# Altium schematic sheet MCU.SchDoc
size A3
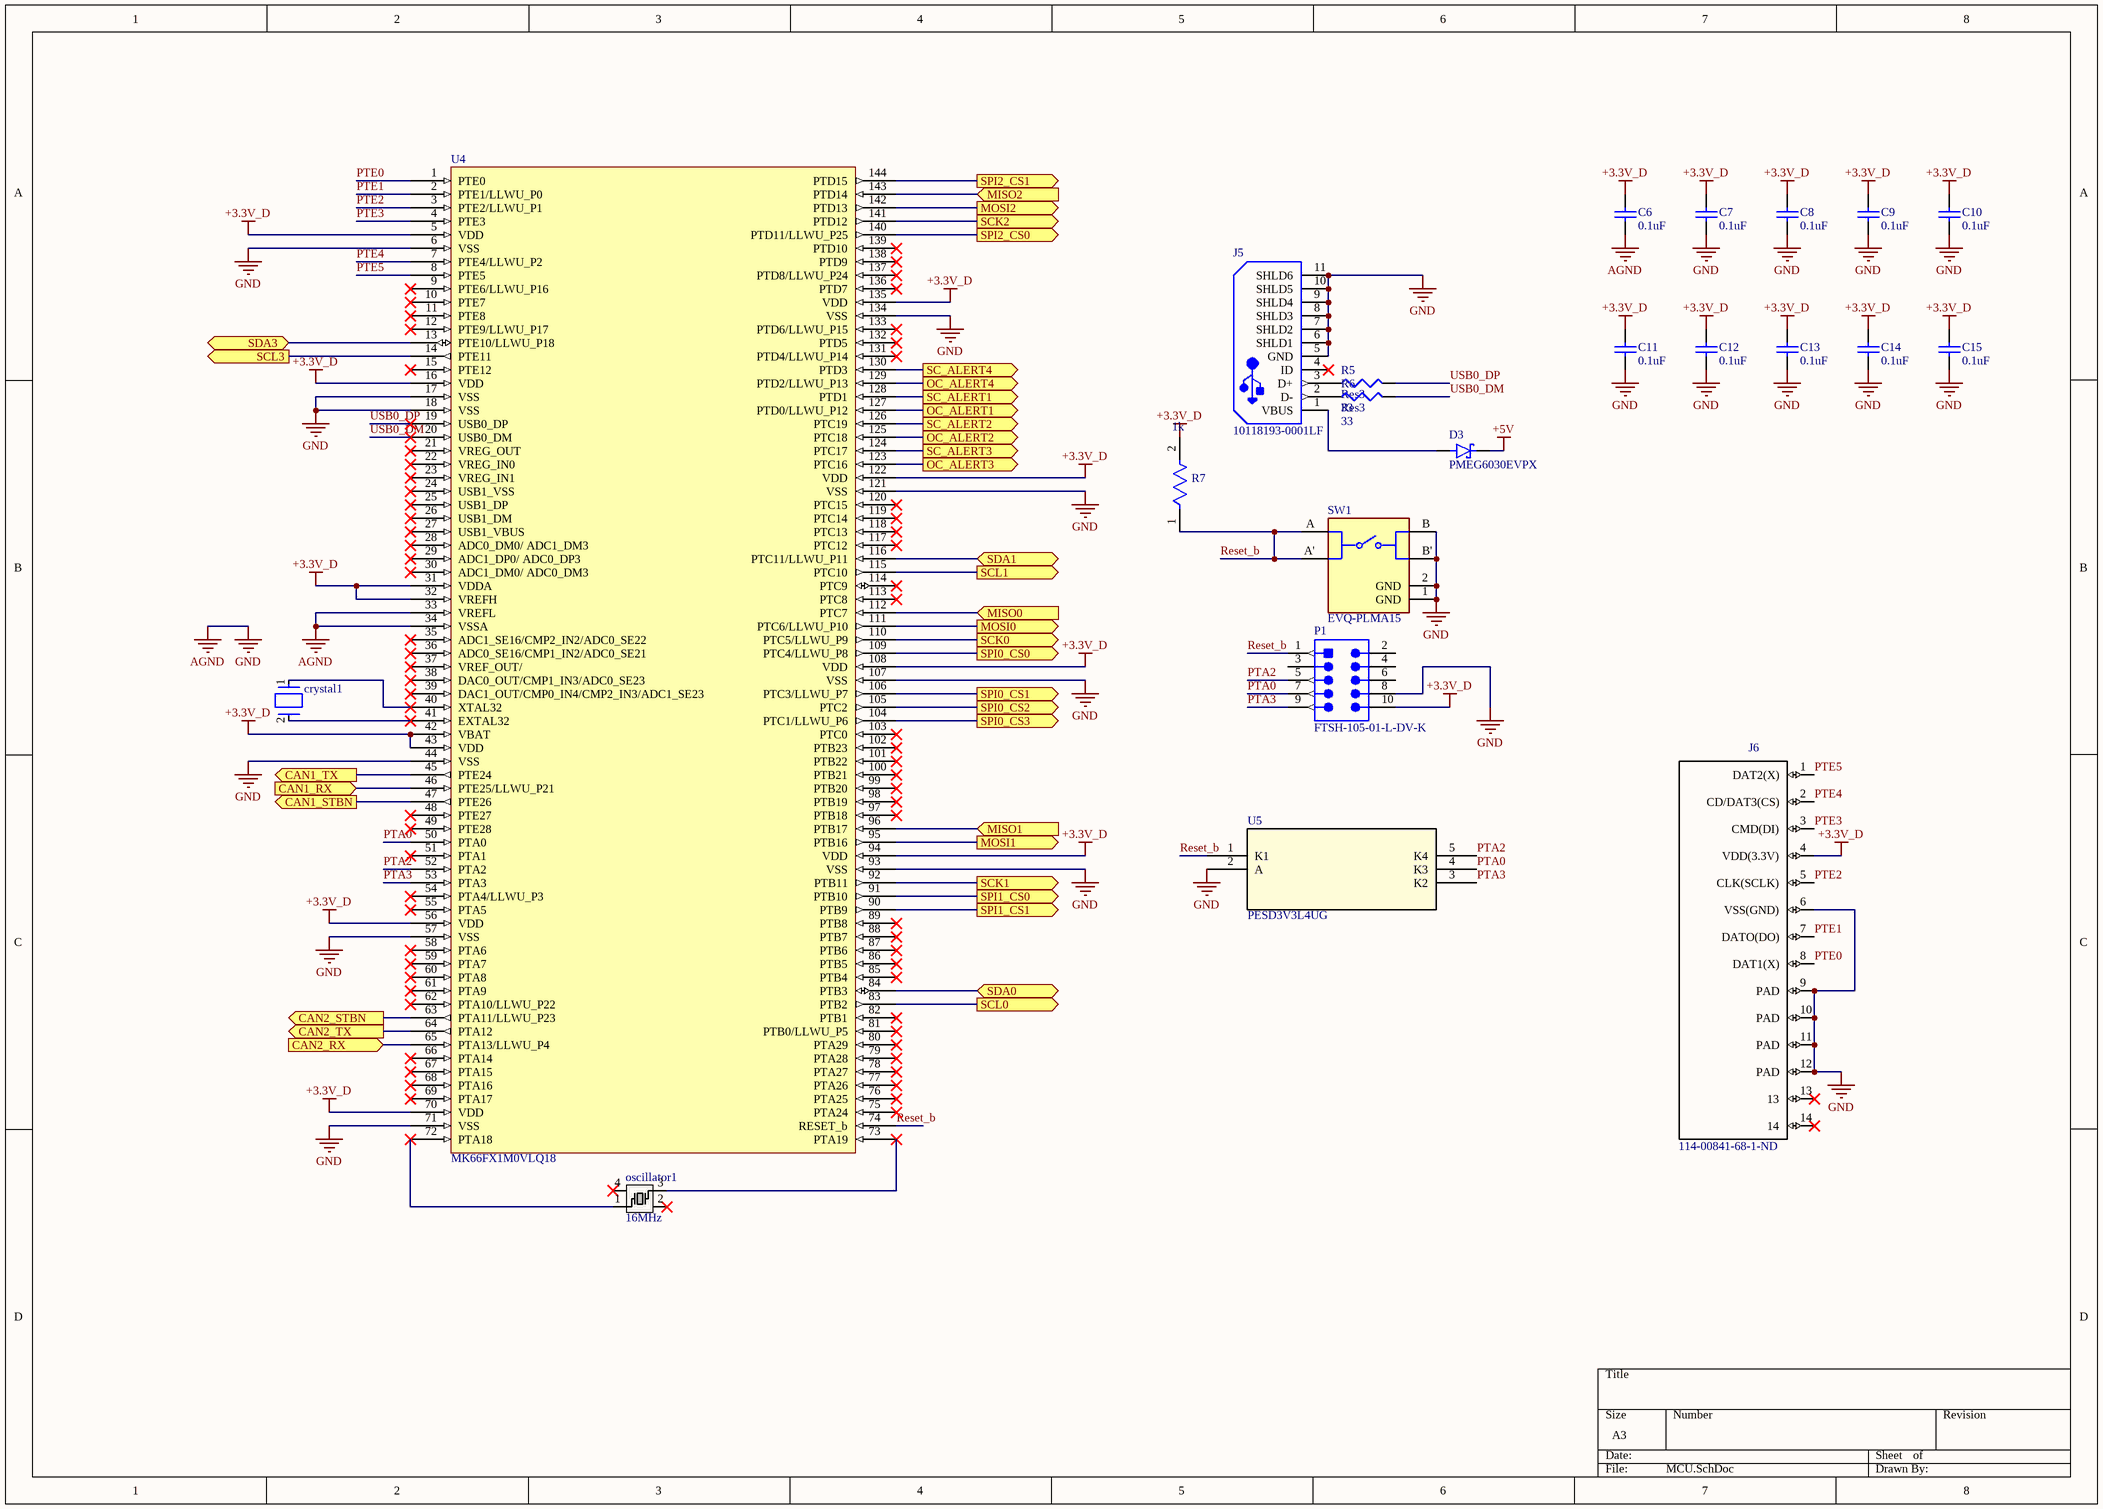
[diagram p0: MCU.SchDoc]

## Parts
C6  0.1uF  [CAPC1608X90X35NL15T15]
C7  0.1uF  [CAPC1608X90X35NL15T15]
C8  0.1uF  [CAPC1608X90X35NL15T15]
C9  0.1uF  [CAPC1608X90X35NL15T15]
C10  0.1uF  [CAPC1608X90X35NL15T15]
C11  0.1uF  [CAPC1608X90X35NL15T15]
C12  0.1uF  [CAPC1608X90X35NL15T15]
C13  0.1uF  [CAPC1608X90X35NL15T15]
C14  0.1uF  [CAPC1608X90X35NL15T15]
C15  0.1uF  [CAPC1608X90X35NL15T15]
crystal1  ABS07-120-32.768KHZ-T  [FP-ABS07-120-MFG]  (value not drawn)
D3  PMEG6030EVPX  [DIO_PMEG6030EVPX]
J5  10118193-0001LF  [FCI-10118193-0001LF-5_V]
J6  Supplier Part Number 1: 114-00841-68-1-ND  [*1140084168]  (hidden comment: 1140084168)
oscillator1  value 16MHz  [ECS-160-8-30B-CKM]  (hidden comment: SMD_oscillator)
P1  FTSH-105-01-L-DV-K  [SMTC-FTSH-105-01-L-DV-K_V]
R5  Res3  value 33  [J1-0603]
R6  Res3  value 33  [J1-0603]
R7  Resistance: 1k  [FP-CRCW0603-e3-MFG]  (hidden comment: CRCW06031K00FKEA)
SW1  EVQ-PLMA15  [FP-EVQ-PLMA15-MFG]
U4  MK66FX1M0VLQ18  [98ASS23177W]
U5  PESD3V3L4UG  [SOT353_NXP]

## Ports
CAN1_RX (in), CAN1_STBN (out), CAN1_TX (out), CAN2_RX (in), CAN2_STBN (out), CAN2_TX (out), MISO0 (in), MISO1 (in), MISO2 (in), MOSI0 (out), MOSI1 (out), MOSI2 (out), OC_ALERT1 (out), OC_ALERT2 (out), OC_ALERT3 (out), OC_ALERT4 (out), SC_ALERT1 (out), SC_ALERT2 (out), SC_ALERT3 (out), SC_ALERT4 (out), SCK0 (out), SCK1 (out), SCK2 (out), SCL0 (out), SCL1 (out), SCL3 (out), SDA0 (bidir), SDA1 (bidir), SDA3 (bidir), SPI0_CS0 (out), SPI0_CS1 (out), SPI0_CS2 (out), SPI0_CS3 (out), SPI1_CS0 (out), SPI1_CS1 (out), SPI2_CS0 (out), SPI2_CS1 (out)

## Nets
+3.3V_D: C6.2 C7.2 C8.2 C9.2 C10.2 C11.2 C12.2 C13.2 C14.2 C15.2 J6.4(VDD(3.3V)) P1.10 R7.2 U4.5(VDD) U4.16(VDD) U4.31(VDDA) U4.32(VREFH) U4.42(VBAT) U4.43(VDD) U4.56(VDD) U4.70(VDD) U4.94(VDD) U4.108(VDD) U4.122(VDD) U4.135(VDD)
+5V: D3.1(K)
AGND: C6.1 C7.1 C8.1 C9.1 C10.1 C11.1 C12.1 C13.1 C14.1 C15.1 J5.5(GND) J5.6(SHLD1) J5.7(SHLD2) J5.8(SHLD3) J5.9(SHLD4) J5.10(SHLD5) J5.11(SHLD6) J6.6(VSS(GND)) J6.9(PAD) J6.10(PAD) J6.11(PAD) J6.12(PAD) P1.8 SW1.1(GND) SW1.2(GND) SW1.B SW1.B' U4.6(VSS) U4.17(VSS) U4.18(VSS) U4.33(VREFL) U4.34(VSSA) U4.44(VSS) U4.57(VSS) U4.71(VSS) U4.93(VSS) U4.107(VSS) U4.121(VSS) U4.134(VSS) U5.2(A)  [also labelled GND]
CAN1_RX: U4.46(PTE25/LLWU_P21) ; port CAN1_RX
CAN1_STBN: U4.47(PTE26) ; port CAN1_STBN
CAN1_TX: U4.45(PTE24) ; port CAN1_TX
CAN2_RX: U4.65(PTA13/LLWU_P4) ; port CAN2_RX
CAN2_STBN: U4.63(PTA11/LLWU_P23) ; port CAN2_STBN
CAN2_TX: U4.64(PTA12) ; port CAN2_TX
MISO0: U4.112(PTC7) ; port MISO0
MISO1: U4.96(PTB17) ; port MISO1
MISO2: U4.143(PTD14) ; port MISO2
MOSI0: U4.111(PTC6/LLWU_P10) ; port MOSI0
MOSI1: U4.95(PTB16) ; port MOSI1
MOSI2: U4.142(PTD13) ; port MOSI2
OC_ALERT1: U4.127(PTD0/LLWU_P12) ; port OC_ALERT1
OC_ALERT2: U4.125(PTC18) ; port OC_ALERT2
OC_ALERT3: U4.123(PTC16) ; port OC_ALERT3
OC_ALERT4: U4.129(PTD2/LLWU_P13) ; port OC_ALERT4
PTA0: P1.7 U4.50(PTA0) U5.4(K3)
PTA2: P1.5 U4.52(PTA2) U5.5(K4)
PTA3: P1.9 U4.53(PTA3) U5.3(K2)
PTE0: J6.8(DAT1(X)) U4.1(PTE0)
PTE1: J6.7(DATO(DO)) U4.2(PTE1/LLWU_P0)
PTE2: J6.5(CLK(SCLK)) U4.3(PTE2/LLWU_P1)
PTE3: J6.3(CMD(DI)) U4.4(PTE3)
PTE4: J6.2(CD/DAT3(CS)) U4.7(PTE4/LLWU_P2)
PTE5: J6.1(DAT2(X)) U4.8(PTE5)
Reset_b: P1.1 R7.1 SW1.A SW1.A' U4.74(RESET_b) U5.1(K1)
SC_ALERT1: U4.128(PTD1) ; port SC_ALERT1
SC_ALERT2: U4.126(PTC19) ; port SC_ALERT2
SC_ALERT3: U4.124(PTC17) ; port SC_ALERT3
SC_ALERT4: U4.130(PTD3) ; port SC_ALERT4
SCK0: U4.110(PTC5/LLWU_P9) ; port SCK0
SCK1: U4.92(PTB11) ; port SCK1
SCK2: U4.141(PTD12) ; port SCK2
SCL0: U4.83(PTB2) ; port SCL0
SCL1: U4.115(PTC10) ; port SCL1
SCL3: U4.14(PTE11) ; port SCL3
SDA0: U4.84(PTB3) ; port SDA0
SDA1: U4.116(PTC11/LLWU_P11) ; port SDA1
SDA3: U4.13(PTE10/LLWU_P18) ; port SDA3
SPI0_CS0: U4.109(PTC4/LLWU_P8) ; port SPI0_CS0
SPI0_CS1: U4.106(PTC3/LLWU_P7) ; port SPI0_CS1
SPI0_CS2: U4.105(PTC2) ; port SPI0_CS2
SPI0_CS3: U4.104(PTC1/LLWU_P6) ; port SPI0_CS3
SPI1_CS0: U4.91(PTB10) ; port SPI1_CS0
SPI1_CS1: U4.90(PTB9) ; port SPI1_CS1
SPI2_CS0: U4.140(PTD11/LLWU_P25) ; port SPI2_CS0
SPI2_CS1: U4.144(PTD15) ; port SPI2_CS1
USB0_DM: R6.2 U4.20(USB0_DM)
USB0_DP: R5.2 U4.19(USB0_DP)
Netcrystal1_1: crystal1.1 U4.40(XTAL32)
Netcrystal1_2: crystal1.2 U4.41(EXTAL32)
NetD3_2: D3.2(A) J5.1(VBUS)
NetJ5_2: J5.2(D-) R6.1
NetJ5_3: J5.3(D+) R5.1
Netoscillator1_1: oscillator1.1 U4.72(PTA18)
Netoscillator1_3: oscillator1.3 U4.73(PTA19)

Not connected (* = marked no-connect by the designer): J5 4(ID)*; J6 13* 14*; oscillator1 2* 4*; P1 2 3 4 6; U4 9(PTE6/LLWU_P16)* 10(PTE7)* 11(PTE8)* 12(PTE9/LLWU_P17)* 15(PTE12)* 21(VREG_OUT)* 22(VREG_IN0)* 23(VREG_IN1)* 24(USB1_VSS)* 25(USB1_DP)* 26(USB1_DM)* 27(USB1_VBUS)* 28(ADC0_DM0/_ADC1_DM3)* 29(ADC1_DP0/_ADC0_DP3)* 30(ADC1_DM0/_ADC0_DM3)* 35(ADC1_SE16/CMP2_IN2/ADC0_SE22)* 36(ADC0_SE16/CMP1_IN2/ADC0_SE21)* 37(VREF_OUT/)* 38(DAC0_OUT/CMP1_IN3/ADC0_SE23)* 39(DAC1_OUT/CMP0_IN4/CMP2_IN3/ADC1_SE23)* 48(PTE27)* 49(PTE28)* 51(PTA1)* 54(PTA4/LLWU_P3)* 55(PTA5)* 58(PTA6)* 59(PTA7)* 60(PTA8)* 61(PTA9)* 62(PTA10/LLWU_P22)* 66(PTA14)* 67(PTA15)* 68(PTA16)* 69(PTA17)* 75(PTA24)* 76(PTA25)* 77(PTA26)* 78(PTA27)* 79(PTA28)* 80(PTA29)* 81(PTB0/LLWU_P5)* 82(PTB1)* 85(PTB4)* 86(PTB5)* 87(PTB6)* 88(PTB7)* 89(PTB8)* 97(PTB18)* 98(PTB19)* 99(PTB20)* 100(PTB21)* 101(PTB22)* 102(PTB23)* 103(PTC0)* 113(PTC8)* 114(PTC9)* 117(PTC12)* 118(PTC13)* 119(PTC14)* 120(PTC15)* 131(PTD4/LLWU_P14)* 132(PTD5)* 133(PTD6/LLWU_P15)* 136(PTD7)* 137(PTD8/LLWU_P24)* 138(PTD9)* 139(PTD10)*

## Library data of the parts
C6-C15 = CMP-2006-04489-1: Part Number: 0603YC104JAT2A; Manufacturer: AVX Interconnect / Elco
crystal1 = CMP-2000-07587-2: CRYSTAL 32.7680KHZ 6PF SMD; Frequency Tolerance: 20ppm; Series Resistance: 60kR; ESR (Equivalent Series Resistance): 55kR; Depth: 1.5mm; Width: 0.061inch; Number of Pins: 2; Max Operating Temperature: 85°C; Length: 3.2mm; Case/Package: SMD/SMT; Series: ABS07; Lead Free: Lead Free; Min Operating Temperature: -40°C; Load Capacitance: 6pF; Packaging: Tape and Reel; Height: 0.035inch; Radiation Hardening: No; Tolerance: 20ppm; Operating Frequency: 32.768 kHz; Termination: SMD/SMT; REACH SVHC: No SVHC; RoHS Compliant: Yes; Frequency: 32.768kHz; Package Quantity: 3000; Mount: Surface Mount
D3 = PMEG6030EVPX: Diode Schottky 60V 3A Surface Mount SOD-128/CFP5; MF: Nexperia USA; Price: None; Value: *; Package: SOD-128 Nexperia; Availability: Unavailable; SnapEDA_Link: https://www.snapeda.com/parts/PMEG6030EVPX/Nexperia%20USA%20Inc./view-part/2755440/?ref=snap; MP: PMEG6030EVPX
J5 = CMP-2000-05119-1: Micro USB B Type Receptacle, -55 to 85 degC, 5-Pin SMD, RoHS, Tape and Reel; Manufacturer: FCI; Insulation Resistance: 1000MOhms; Gender: Female; Current Rating: 1.8A; Number of Contacts: 5Contact; Connector Type: MicroUSBTypeBreceptacle; Mounting Angle: Right; Datasheet Version: Rev. C, 05/2015; Packaging: Reel; Product Category: USBConnectors; Standard: USB2.0; Factory Pack Quantity: 1200; Operating Temperature Range: -55Cto+85C; Termination Style: SMD/SMT; Datasheet URL: http://datasheet.octopart.com/10118193-0001LF-FCI-datasheet-55953155.pdf; Contact Material: CopperAlloy; RoHS: Details; Contact Plating: Gold; Flammability Rating: UL94V-0; Manufacturer URL: http://www.fci.com/; Brand: FCI; Product: MicroUSBTypeBConnectors; Color: Black
J6 = 1140084168: Conn; IC Socket; Micro SD; Right Angle; PCB Mount; MicroSD Ser.; Manufacturer: Amphenol Commercial; MF: Amphenol ICC; Connector Type: Connector; Number of Contacts: 8; Gender: Receptacle; Pitch: 1.1mm; Package: None; MP: 1140084168; SnapEDA_Link: https://www.snapeda.com/parts/1140084168/Amphenol%20ICC/view-part/?ref=snap; Digi-Key_Purchase_URL: https://www.digikey.ca/product-detail/en/amphenol-icc-commercial-products/114-00841-68/114-00841-68-1-ND/2187101?utm_source=snapeda&utm_medium=aggregator&utm_campaign=symbol; Digi-Key_Part_Number: 114-00841-68-1-ND; Value: *; Supplier 1: Digi-Key; Manufacturer Part Number: 1140084168; RoHS: Yes; Category: Memory Connectors; Stock 1: 27520; Pricing 1: 1=1.28000, 10=1.13000, 25=1.06320, 50=1.01900, 100=0.97480, 250=0.88616, 500=0.79752 (USD); Mount: Surface Mount; Contact Plating: Gold; Housing Material: Polymer; Contact Material: Copper Alloy,Copper; Packaging: Tape and Reel; Orientation: Right Angle; Package Quantity: 7500; Number of Rows: 1; Termination: SMD/SMT; Length: 15.6mm; Height: 1.55mm; Depth: 11.45mm; Radiation Hardening: No; REACH SVHC: Unknown; Flammability Rating: UL94 V-0; Lead Free: Lead Free; ComponentLink1URL: https://datasheet.ciiva.com/24241/11400841-283410-24241569.pdf?src-supplier=Mouser; ComponentLink1Description: https://datasheet.ciiva.com/24241/11400841-283410-24241569.pdf?src-supplier=Mouser; ComponentLink2URL: https://datasheet.ciiva.com/28408/11400841-28408193.pdf?src-supplier=Element14; ComponentLink2Description: https://datasheet.ciiva.com/28408/11400841-28408193.pdf?src-supplier=Element14; ComponentLink3URL: https://datasheet.ciiva.com/9464/1140084168-9464901.pdf?src-supplier=Avnet; ComponentLink3Description: https://datasheet.ciiva.com/9464/1140084168-9464901.pdf?src-supplier=Avnet; ComponentLink4URL: https://datasheet.ciiva.com/48965/70323450-48965706.pdf?src-supplier=Allied+Electronics; ComponentLink4Description: https://datasheet.ciiva.com/48965/70323450-48965706.pdf?src-supplier=Allied+Electronics; ComponentLink5URL: https://datasheet.ciiva.com/16655/1140084168-16655293.pdf?src-supplier=Avnet+Europe; ComponentLink5Description: https://datasheet.ciiva.com/16655/1140084168-16655293.pdf?src-supplier=Avnet+Europe
oscillator1 = ECS-160-8-30B-CKM: SPN: XC1839CT-ND
P1 = CMP-2000-05353-1: Male Header, Pitch 1.27 mm, 2 x 5 Position, Height 6.25 mm; Manufacturer: Samtec; Pitch: 0.050"(1.27mm); Other Names: Q3937619; Number of Positions: 10; Mating Products: SFMC-105-L2-S-D-TR-ND / -CONN.05"SURFACE10POSSMT / FLE-105-01-G-DV-TR-ND / -CONNSKT1.27MM10POSDUALSMD / FLE-105-01-G-DV-A-P-ND / -CONNSKT1.27MM10POSDUALSMD / FLE-105-01-G-DV-A-ND / -CONNSKT1.27MM10POSDUALSMD / CLP-105-02-G-D-P-TR-ND / -CONNRCPT10POSDUAL.05"SMD / SAM1155-05-ND / -CONNRCPT10POSDUAL.05"SMD / SAM1154-05-ND / -CONNRCPT10POSDUAL.05"SMD / SAM1153-05-ND / -CONNRCPT10POSDUAL.05"SMD / SAM1226-05-ND / -CONNRCPT.05"10POSDUALSMD; Number of Positions Loaded: All; Connector Type: Header,Unshrouded; Product Training Modules: Board-to-BoardConnectors; Datasheet Version: Rev. ET, 10/1995; Number of Rows: 2; Standard Package: 1; Package Description: Male Header, Pitch 1.27 mm, 2 x 5 Position, Height 5.97 mm, Tail Length 4.32 mm; Contact Finish Thickness: 10µin(0.25µm); Series: FTSH; Termination: Solder; Contact Type: MalePin; Color: Black; Package Reference: FTSH-105-01-L-DV-K; Family: RectangularConnectors-Headers,MalePins; Package URL: http://suddendocs.samtec.com/prints/ftsh-1xx-xx-xxx-dv-xxx-footprint.pdf; Packaging: Tube; Mounting Type: SurfaceMount; Category: Connectors,Interconnects; Datasheet URL: http://suddendocs.samtec.com/prints/ftsh-1xx-xx-xxx-dv-xxx-mkt.pdf; Row Spacing: 0.050"(1.27mm); Manufacturer URL: http://www.samtec.com/; Contact Mating Length: 0.120"(3.05mm); Contact Finish: Gold
R5 R6 = Res3: VISHAY - CRCW060333R0FKEA. - Resistore su Chip a Mont. Superficiale, Film Spesso, 0603 [1608 Metrico], 33 ohm, Serie CRCW, 75 V; SPN: 541-2782-1-ND; Resistance: 33R; Tolerance: 1%; Temperature Coefficient: 100ppm/°C; Power Rating: 100mW; Voltage Rating: 75V; Published: 8-Jun-2000; LatestRevisionDate: 29-May-2009; LatestRevisionNote: IPC-7351 Footprint Added.; PackageReference: J1-0603; Publisher: Altium Limited; PackageDescription: Chip Resistor; Supplier 1: Digi-Key; Supplier Part Number 1: 541-33.0HCT-ND; Manufacturer: Vishay; Manufacturer Part Number: CRCW060333R0FKEA; RoHS: Yes; Category: Chip SMD Resistors; Stock 1: 59910; Pricing 1: 1=0.10000, 10=0.03300, 100=0.01340, 1000=0.00602, 2500=0.00522 (USD); Mount: Surface Mount; Case/Package: 0603; Weight: 7.1E-05oz; Case Code (Imperial): 0603; Case Code (Metric): 1608; Contact Plating: Tin; Min Operating Temperature: -55°C; Max Operating Temperature: 155°C; Composition: Thick Film; Packaging: Tape and Reel; Number of Terminations: 2; Max Power Dissipation: 100mW; Voltage Rating (DC): 75V; Package Quantity: 10; Military Standard: Not; Termination: SMD/SMT; Features: Automotive AEC-Q200; Length: 1.55mm; Height: 0.45mm; Width: 0.85mm; Depth: 0.85mm; Radiation Hardening: No; Lead Free: Lead Free; REACH SVHC: Unknown; ComponentLink1URL: https://datasheet.ciiva.com/11809/0900766b80d98afc-11809158.pdf?src-supplier=RSComponents; ComponentLink1Description: https://datasheet.ciiva.com/11809/0900766b80d98afc-11809158.pdf?src-supplier=RSComponents; ComponentLink2URL: https://datasheet.ciiva.com/7777/1697337-7777317.pdf?src-supplier=Element14; ComponentLink2Description: https://datasheet.ciiva.com/7777/1697337-7777317.pdf?src-supplier=Element14; ComponentLink3URL: https://datasheet.ciiva.com/7777/1720486-7777557.pdf?src-supplier=Element14; ComponentLink3Description: https://datasheet.ciiva.com/7777/1720486-7777557.pdf?src-supplier=Element14; ComponentLink4URL: https://datasheet.ciiva.com/16783/70201119-16783349.pdf?src-supplier=Allied+Electronics; ComponentLink4Description: https://datasheet.ciiva.com/16783/70201119-16783349.pdf?src-supplier=Allied+Electronics; ComponentLink5URL: https://datasheet.ciiva.com/7777/1720486-7777558.pdf?src-supplier=Element14; ComponentLink5Description: https://datasheet.ciiva.com/7777/1720486-7777558.pdf?src-supplier=Element14; ComponentLink6URL: https://datasheet.ciiva.com/16771/70201119-16771126.pdf?src-supplier=Allied+Electronics; ComponentLink6Description: https://datasheet.ciiva.com/16771/70201119-16771126.pdf?src-supplier=Allied+Electronics; ComponentLink7URL: https://datasheet.ciiva.com/2465/dcrcwe3-2465591.pdf?src-supplier=Digi-Key; ComponentLink7Description: https://datasheet.ciiva.com/2465/dcrcwe3-2465591.pdf?src-supplier=Digi-Key; ComponentLink8URL: https://datasheet.ciiva.com/2465/dcrcwe3-2465592.pdf?src-supplier=Digi-Key; ComponentLink8Description: https://datasheet.ciiva.com/2465/dcrcwe3-2465592.pdf?src-supplier=Digi-Key; ComponentLink9URL: https://datasheet.ciiva.com/2465/dcrcwe3-2465593.pdf?src-supplier=Digi-Key; ComponentLink9Description: https://datasheet.ciiva.com/2465/dcrcwe3-2465593.pdf?src-supplier=Digi-Key; ComponentLink10URL: https://datasheet.ciiva.com/16893/dcrcwe3-16893242.pdf?src-supplier=Avnet+Europe; ComponentLink10Description: https://datasheet.ciiva.com/16893/dcrcwe3-16893242.pdf?src-supplier=Avnet+Europe
R7 = CMP-1666-00003-5: RES Thick Film, 1kΩ, 1%, 0.1W, 100ppm/°C, 0603; Max Power Dissipation: 100mW; Voltage Rating: 75V; Max Operating Temperature: 155°C; Number of Pins: 2; Case Code (Imperial): 0603; Width: 0.033inch; Power Rating: 100mW; Number of Terminations: 2; Package Quantity: 10; Weight: 7.1E-05oz; Tolerance: 1%; Temperature Coefficient: 100ppm/°C; Military Standard: Not; Mount: Surface Mount; Voltage Rating (DC): 75V; Depth: 0.85mm; Composition: Thick Film; Radiation Hardening: No; Termination: SMD/SMT; Length: 1.55mm; Case Code (Metric): 1608; Contact Plating: Tin; Min Operating Temperature: -55°C; Packaging: Tape and Reel; Height: 0.45mm; Lead Free: Lead Free; Case/Package: 0603; Features: Automotive AEC-Q200
SW1 = CMP-05618-000006-1: SWITCH TACTILE SPST-NO 0.02A 15V; Manufacturer: Panasonic Electronic Components; Operating Force: 2.6N; Contact Resistance: 50mΩ; Contact Current Rating: 20mA; Electromechanical Life: 200000Cycles; Throw Configuration: SPST-NO; Automotive: No; Digikey Description: SWITCH TACTILE SPST-NO 0.02A 15V; Device Class L3: Tactile Switches; Device Class L2: Switches; Temperature Range Low: -20°C; ComponentLink2Description: Datasheet; RoHS: TRUE; Mount: Surface Mount; Package: 0; Height: 1.7mm; Octopart: https://octopart.com/evq-plma15-panasonic-39850235; Temperature Range High: +70°C; Device Class L1: Electromechanical; Category: Switch; Mouser Description: Tactile Switches FLAT ACT 2.6NF 4.6x3.4x1.5mm; Voltage Rating Dc: 15V; Manufacturer Part Number: EVQ-PLMA15; ComponentLink2URL: https://datasheet.ciiva.com/8164/atv0000ce2-8164994.pdf; Lead Free: Yes; Temperature: -20°C to +70°C
U4 = Component_1
U5 = PESD3V3L4UG: No Description Available; Vendor: NXP; Built_By: EMA_UL_Team; SourceLibrary: NXP_2011-11-10; Manufacturer_Part_Number: PESD3V3L4UG; Copyright: Copyright (C) 2018 Accelerated Designs. All rights reserved; RefDes: RefDes; Type: DEV